# EAGLE design schematic (EAGLE 9.2.0)
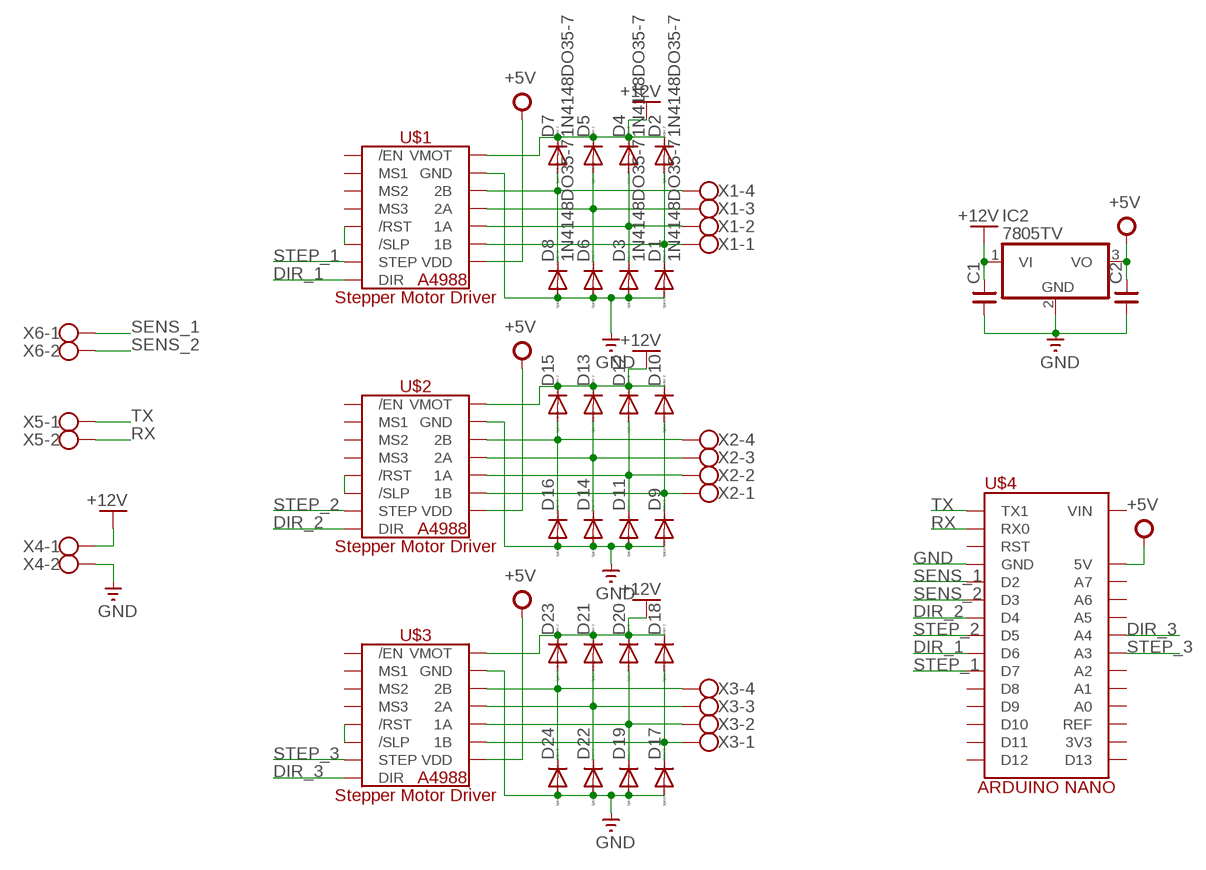
[diagram p0: schematic, sheet 1]

## Parts
C1  CNP-C035-055X025  [C035-055X025]
C2  CNP-C035-055X025  [C035-055X025]
D1  1N4148DO35-7  [DO35-7]
D2  1N4148DO35-7  [DO35-7]
D3  1N4148DO35-7  [DO35-7]
D4  1N4148DO35-7  [DO35-7]
D5  1N4148DO35-7  [DO35-7]
D6  1N4148DO35-7  [DO35-7]
D7  1N4148DO35-7  [DO35-7]
D8  1N4148DO35-7  [DO35-7]
D9  1N4148DO35-7  [DO35-7]
D10  1N4148DO35-7  [DO35-7]
D11  1N4148DO35-7  [DO35-7]
D12  1N4148DO35-7  [DO35-7]
D13  1N4148DO35-7  [DO35-7]
D14  1N4148DO35-7  [DO35-7]
D15  1N4148DO35-7  [DO35-7]
D16  1N4148DO35-7  [DO35-7]
D17  1N4148DO35-7  [DO35-7]
D18  1N4148DO35-7  [DO35-7]
D19  1N4148DO35-7  [DO35-7]
D20  1N4148DO35-7  [DO35-7]
D21  1N4148DO35-7  [DO35-7]
D22  1N4148DO35-7  [DO35-7]
D23  1N4148DO35-7  [DO35-7]
D24  1N4148DO35-7  [DO35-7]
IC2  7805TV  [TO220V]
U$1  A4988_STEP  [A4988_STEP]
U$2  A4988_STEP  [A4988_STEP]
U$3  A4988_STEP  [A4988_STEP]
U$4  NANO_HEADER  [NANO_HEADER]
X1  W237-4  [W237-4]
X2  W237-4  [W237-4]
X3  W237-4  [W237-4]
X4  W237-102  [W237-102]
X5  W237-102  [W237-102]
X6  W237-102  [W237-102]

## Nets
+5V: C2.2 IC2.3(VO) U$1.VDD U$2.VDD U$3.VDD U$4.5V
+12V: C1.2 D2.C D4.C D5.C D7.C D10.C D12.C D13.C D15.C D18.C D20.C D21.C D23.C IC2.1(VI) U$1.VMOT U$2.VMOT U$3.VMOT X4.1
DIR_1: U$1.DIR U$4.D6
DIR_2: U$2.DIR U$4.D4
DIR_3: U$3.DIR U$4.A4
GND: C1.1 C2.1 D1.A D3.A D6.A D8.A D9.A D11.A D14.A D16.A D17.A D19.A D22.A D24.A IC2.2(GND) U$1.GND U$1.GND2(GND) U$2.GND U$2.GND2(GND) U$3.GND U$3.GND2(GND) U$4.GND U$4.GND2(GND) X4.2
N$1: D1.C D2.A U$1.1B X1.1
N$2: U$1./RST U$1./SLP
N$3: D9.C D10.A U$2.1B X2.1
N$4: D3.C D4.A U$1.1A X1.2
N$5: D11.C D12.A U$2.1A X2.2
N$6: D5.A D6.C U$1.2A X1.3
N$7: D7.A D8.C U$1.2B X1.4
N$8: D13.A D14.C U$2.2A X2.3
N$9: D15.A D16.C U$2.2B X2.4
N$10: U$2./RST U$2./SLP
N$11: D17.C D18.A U$3.1B X3.1
N$12: D19.C D20.A U$3.1A X3.2
N$13: D21.A D22.C U$3.2A X3.3
N$17: D23.A D24.C U$3.2B X3.4
N$18: U$3./RST U$3./SLP
RX: U$4.RX0 X5.2
SENS_1: U$4.D2 X6.1
SENS_2: U$4.D3 X6.2
STEP_1: U$1.STEP U$4.D7
STEP_2: U$2.STEP U$4.D5
STEP_3: U$3.STEP U$4.A3
TX: U$4.TX1 X5.1
Unconnected: U$1./EN U$1.MS1 U$1.MS2 U$1.MS3 U$2./EN U$2.MS1 U$2.MS2 U$2.MS3 U$3./EN U$3.MS1 U$3.MS2 U$3.MS3 U$4.3V3 U$4.A0 U$4.A1 U$4.A2 U$4.A5 U$4.A6 U$4.A7 U$4.D8 U$4.D9 U$4.D10 U$4.D11 U$4.D12 U$4.D13 U$4.REF U$4.RST U$4.RST2(RST) U$4.VIN

## Library data of the parts
C1 C2 = cap-master:CNP-: NON-POLARIZED CAP
D1-D24 = diode:1N4148: DIODE high speed (Philips)
IC2 = linear:78*: Positive VOLTAGE REGULATOR Source: http://cache.national.com/ds/LM/LM78L05.pdf http://www.fairchildsemi.com/ds/LM/LM7805.pdf
U$1-U$3 = IC:A4988_STEP
U$4 = IC:NANO_HEADER: Arduino nano V3.0 femal header
X1-X3 = con-wago-500:W237-4: WAGO SCREW CLAMP; OC_FARNELL: unknown; OC_NEWARK: unknown
X4 = con-wago-500:W237-102: WAGO SCREW CLAMP; MPN: 237-102; OC_FARNELL: unknown; OC_NEWARK: 70K9898
X5 X6 = con-wago-500:W237-102: WAGO SCREW CLAMP; MPN: 237-102; OC_FARNELL: unknown; OC_NEWARK: 70K9898; SPICEPREFIX: X

## Board
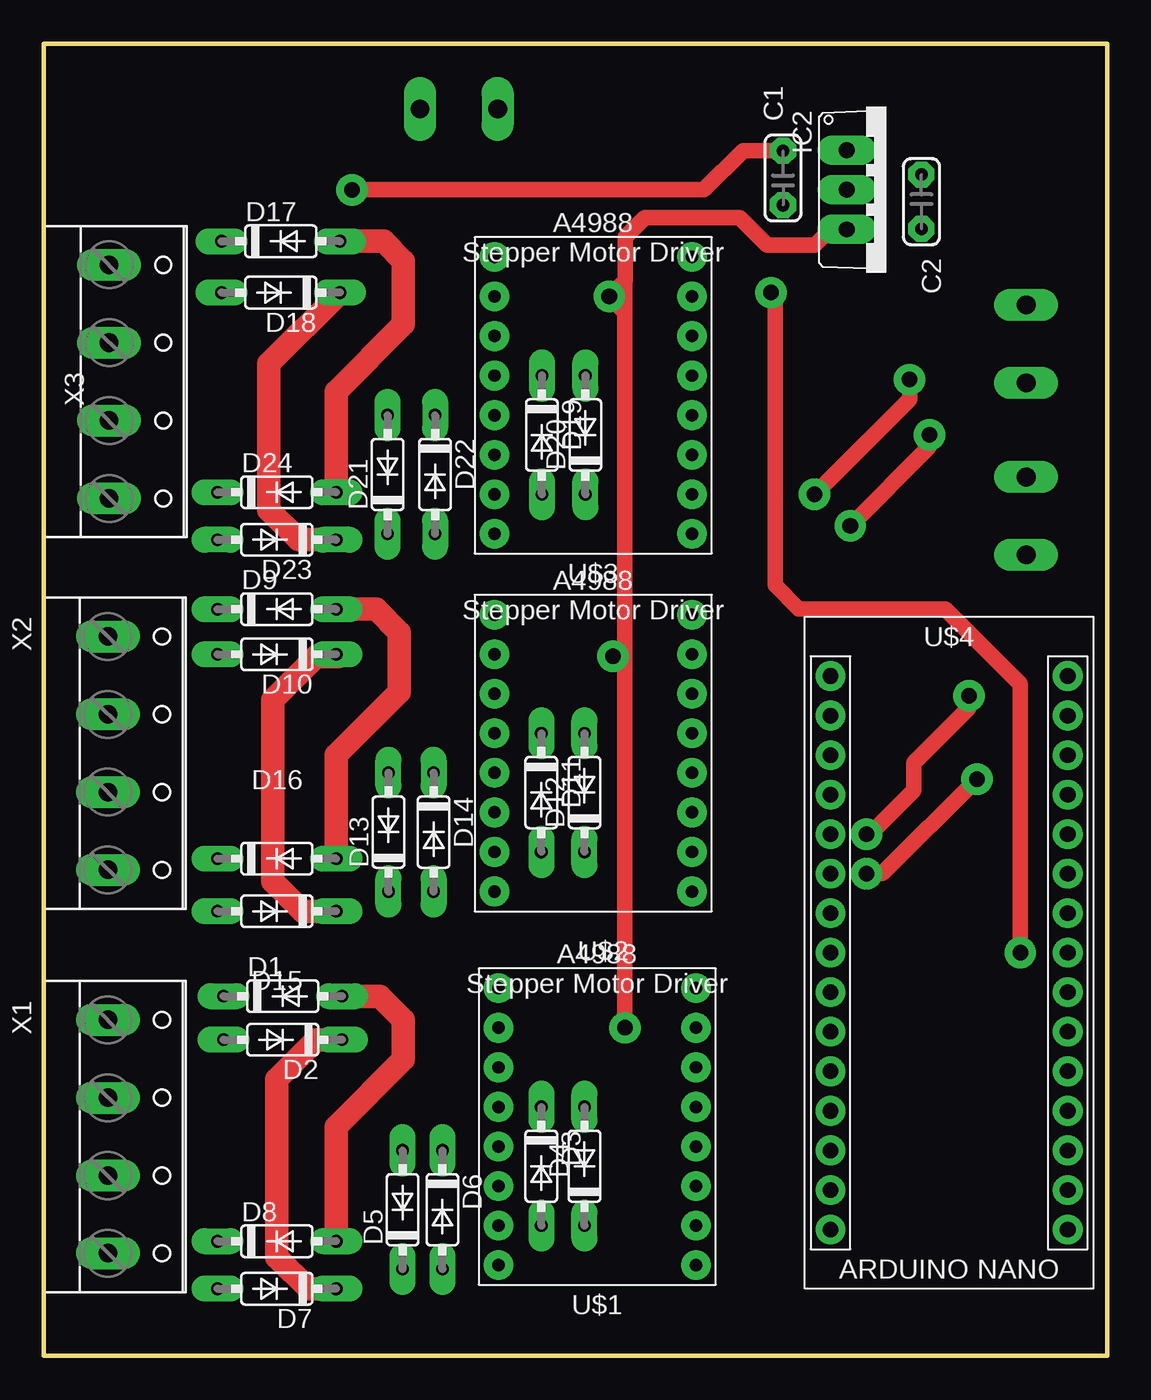
[diagram p1: board, top side]
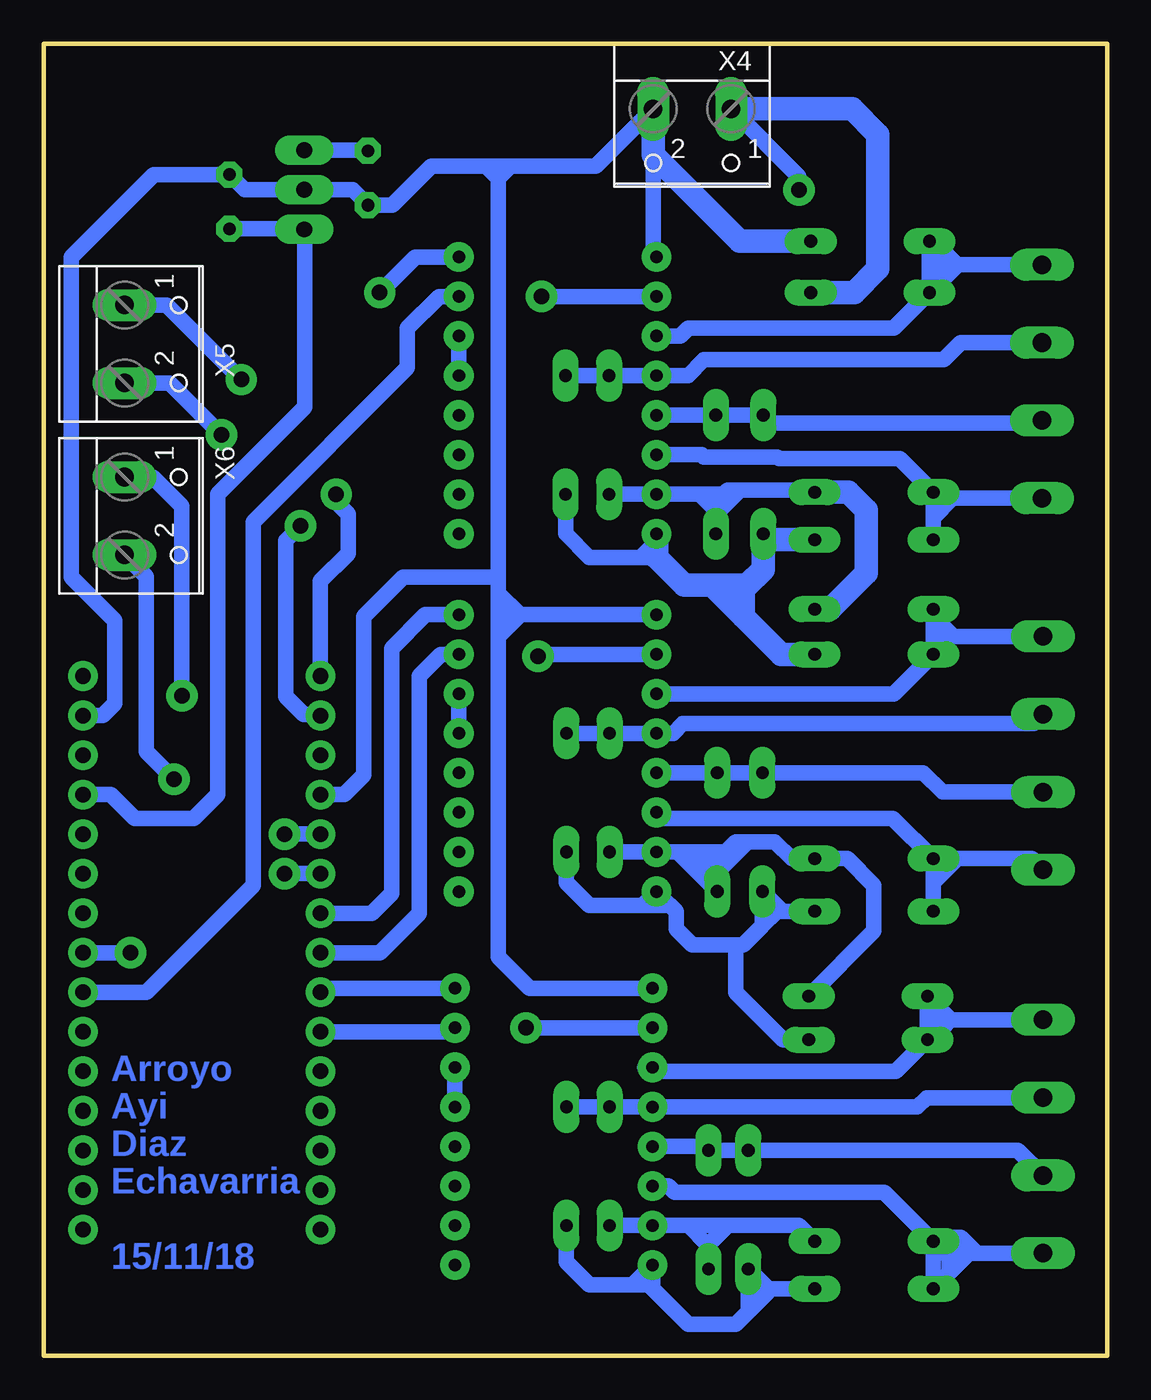
[diagram p2: board, bottom side, seen from below]

Size 68.33 x 84.33 mm. Coordinates in mm from the lower left corner, seen from the top.
Outline: 0,84.33 0,0 68.33,0 68.33,84.33 0,84.33
Copper layers (1*16): Top 0.035mm / dielectric 1.5mm / bottom 0.035mm
Design rules "default *": minimum track width 25mil, minimum drill 0.5mm, track to track 20mil, track to pad 20mil, pad to pad 20mil, via to via 20mil, smd to smd 20mil, copper to edge 40mil, drill to drill 6mil, minimum pad ring 17mil, minimum via ring 20mil, stop-mask expansion 4mil, vias tented up to drill 0mil, thermal gap 10mil

### Footprints (pad centres in the part's own frame; a part is rotated, then mirrored left to right if it is on the bottom)
C035-055X025 = drill 0.813 pad 1.676 octagon: 1 -1.587,0; 2 1.905,0
DO35-7 = drill 0.813 long: A 3.81,0; C -3.81,0
TO220V = drill 1.016 long: 1 -2.54,-2.54; 2 0,-2.54; 3 2.54,-2.54
A4988_STEP = drill 0.8 pad 1.905: 1A 6.35,-1.27; 1B 6.35,-3.81; 2A 6.35,1.27; 2B 6.35,3.81; /EN -6.35,8.89; /RST -6.35,-1.27; /SLP -6.35,-3.81; DIR -6.35,-8.89; GND 6.35,6.35; GND2 6.35,-8.89; MS1 -6.35,6.35; MS2 -6.35,3.81; MS3 -6.35,1.27; STEP -6.35,-6.35; VDD 6.35,-6.35; VMOT 6.35,8.89
NANO_HEADER = drill 1 pad 1.905: 3V3 16.51,6.35; 5V 16.51,31.75; A0 16.51,11.43; A1 16.51,13.97; A2 16.51,16.51; A3 16.51,19.05; A4 16.51,21.59; A5 16.51,24.13; A6 16.51,26.67; A7 16.51,29.21; D2 1.27,29.21; D3 1.27,26.67; D4 1.27,24.13; D5 1.27,21.59; D6 1.27,19.05; D7 1.27,16.51; D8 1.27,13.97; D9 1.27,11.43; D10 1.27,8.89; D11 1.27,6.35; D12 1.27,3.81; D13 16.51,3.81; GND 1.27,31.75; GND2 16.51,36.83; REF 16.51,8.89; RST 1.27,34.29; RST2 16.51,34.29; RX0 1.27,36.83; TX1 1.27,39.37; VIN 16.51,39.37
W237-4 = drill 1.194 long: 1 -7.5,-1.27; 2 -2.5,-1.27; 3 2.5,-1.27; 4 7.5,-1.27
W237-102 = drill 1.194 long: 1 -2.5,-1.27; 2 2.5,-1.27

### Placement (x,y rotation side)
C1  47.5,75.53 90 top
C2  56.39,74.33 270 top
D1  15.37,23.11 0 top
D2  15.37,20.32 180 top
D3  31.97,12.19 270 top
D4  34.74,12.19 90 top
D5  23.06,9.4 90 top
D6  25.62,9.4 270 top
D7  14.99,4.32 180 top
D8  14.99,7.37 0 top
D9  14.99,47.99 0 top
D10  14.99,45.08 180 top
D11  31.97,36.2 270 top
D12  34.74,36.2 90 top
D13  22.15,33.66 90 top
D14  25.06,33.66 270 top
D15  14.99,28.57 180 top
D16  14.99,31.95 0 top
D17  15.24,71.63 0 top
D18  15.24,68.33 180 top
D19  32,59.18 270 top
D20  34.8,59.18 90 top
D21  22.1,56.64 90 top
D22  25.15,56.64 270 top
D23  14.99,52.45 180 top
D24  14.99,55.5 0 top
IC2  54.13,74.93 270 top
U$1  35.56,14.73 180 top
U$2  35.31,38.73 180 top
U$3  35.31,61.72 180 top
U$4  49.28,4.32 0 top
X1  5.4,14.1 270 top
X2  5.4,38.73 270 top
X3  5.47,62.61 270 top
X4  26.67,78.87 180 bottom
X5  61.85,65.02 270 bottom
X6  61.85,53.97 270 bottom

### Tracks (layer width: path | path; a pad name or v marks a point on that pad's centre or on a via)
+5V  (via drill 1 pad 1.5)
  Top 1: IC2.3 50.55,72.39 49.53,71.37 46.48,71.37 44.7,73.15 38.61,73.15 37.35,71.89 37.35,69.09 37.34,69.08 | 37.34,45.72 37.34,44.96 | 37.34,44.96 37.34,44.2 | 37.34,44.2 v37.34,21.08 | 37.34,44.96 v36.58,44.96 | 37.34,45.72 v36.58,44.96 | 37.34,44.2 v36.58,44.96 | 37.34,69.08 37.34,68.07 | 37.34,68.07 37.34,67.07 | 37.34,67.07 37.34,45.72 | 37.34,68.07 v36.33,68.07 | 37.34,69.08 v36.33,68.07 | 37.34,67.07 v36.33,68.07
  bottom 1: U$2.VDD 36.58,45.09 v36.58,44.96 | v36.33,68.07 U$3.VDD | v37.34,21.08 U$1.VDD | C2.2 51.62,72.42 IC2.3 51.56,72.36 51.56,60.96 57.15,55.37 57.15,36.07 58.67,34.54 62.48,34.54 64.01,36.07 U$4.5V
+12V  (via drill 1 pad 1.5)
  Top 1: C1.2 44.93,77.44 42.42,74.93 v19.81,74.93
  Top 1.5: D23.C 16.38,52.45 14.48,54.36 14.48,63.75 D18.C | D15.C 16.64,28.57 14.73,30.48 14.73,42.16 17.53,44.96 18.92,44.96 D10.C | D2.C 17.53,20.32 14.99,17.78 14.99,6.35 17.02,4.32 D7.C
  bottom 1: 20.88,28.57 D15.C | 20.88,28.57 D13.C 22.15,27.63 | 23.88,26.42 23.37,26.42 22.15,27.63 | 23.88,26.42 26.67,26.42 27.69,27.43 27.69,28.57 28.13,29.02 | 28.13,29.02 U$2.VMOT 29.84,28.96 | D12.C 34.74,30.43 33.27,28.96 29.84,28.96 | 29.84,28.96 28.19,28.96 28.13,29.02 | 22.15,27.63 21.21,28.57 20.88,28.57 | D2.C 20.83,20.32 23.88,23.37 23.88,26.42 | 22.32,4.85 D5.C 23.06,2.85 | 22.32,4.85 21.79,4.32 | 29.21,4.32 U$1.VMOT 30.48,4.57 | 29.21,4.32 26.92,2.03 23.88,2.03 23.06,2.85 | 21.79,4.32 D7.C | 23.06,2.85 22.48,3.43 | 22.48,3.43 21.79,4.12 21.79,4.32 | 30.48,4.57 33.27,4.57 34.74,6.04 D4.C | 29.21,4.32 29.46,4.57 30.48,4.57 | D21.C 22.1,52.32 | 28.96,52.32 28.96,51.31 29.97,51.31 | U$3.VMOT 28.96,52.32 | 29.97,51.31 28.96,52.32 | 29.97,51.31 33.27,51.31 34.8,52.83 D20.C | X4.1 19.81,75.78 v19.81,74.93 | IC2.1 47.53,77.47 C1.2 | 22.48,3.43 22.48,4.7 22.32,4.85
  bottom 1.5: U$3.VMOT 28.96,51.31 27.18,49.53 25.4,49.53 | 25.4,49.53 25.15,49.53 | 25.15,49.53 23.11,49.53 | 23.11,49.53 22.1,50.55 22.1,52.32 | D23.C 21.72,52.45 D21.C | D10.C 20.95,45.09 23.37,47.5 | 23.37,47.75 23.37,49.28 23.11,49.53 | 23.37,47.75 23.37,47.5 | 25.15,49.53 23.37,47.75 | 25.4,49.53 23.37,47.5 | X4.1 16.38,80.14 14.73,78.49 14.73,69.85 16.26,68.33 D18.C
DIR_1
  bottom 1: U$4.D6 50.29,23.62 U$1.DIR
DIR_2
  bottom 1: U$4.D4 47.24,28.45 45.97,29.72 45.97,45.47 43.81,47.62 U$2.DIR
DIR_3  (via drill 1 pad 1.5)
  Top 1: v46.74,68.33 46.99,68.07 46.99,49.53 48.51,48.01 57.91,48.01 62.74,43.18 v62.74,25.91
  bottom 1: U$3.DIR 44.45,70.61 v46.74,68.33 | U$4.A4 v62.74,25.91
GND
  Top 1.5: D16.A 18.8,38.61 22.86,42.67 22.86,46.48 21.35,47.99 D9.A | D8.A 18.8,14.73 23.11,19.05 23.11,21.59 21.59,23.11 D1.A | D24.A 18.8,61.98 23.11,66.29 23.11,70.36 21.84,71.63 D17.A
  bottom 1: D11.A U$2.GND 27.59,32.38 | 26.96,31.75 D14.A | D14.A 25.15,29.94 25.15,30.99 | 25.15,31.75 25.15,30.99 | 23.11,33.04 21.35,33.04 20.27,31.95 D16.A 16.71,31.95 14.99,30.23 14.99,27.3 D1.A | 23.11,33.04 23.86,33.04 24.51,32.38 | 25.15,31.75 24.51,32.38 | 25.91,31.75 25.15,31.75 | 26.96,31.75 25.91,31.75 | 27.59,32.38 26.96,31.75 | 25.91,31.75 25.15,30.99 | 27.59,32.38 24.51,32.38 | D14.A 25.05,31.09 23.11,33.04 | D8.A 19.81,8.38 24.38,8.38 | 26.92,8.38 24.38,8.38 | 26.92,8.38 U$1.GND D3.A | 26.92,8.38 25.62,7.08 D6.A 25.62,7.15 24.38,8.38 | D19.A U$3.GND 26.16,55.37 | 39.12,46.23 39.12,25.65 37.08,23.62 U$1.GND2 | 39.12,46.48 39.12,46.23 | 39.12,47.75 39.12,46.48 | 39.12,49.02 39.12,47.75 | 39.12,49.02 37.72,47.62 | 37.72,47.62 37.97,47.62 38.48,47.12 | 39.12,46.48 38.48,47.12 | 39.12,46.23 37.72,47.62 | 39.12,47.75 38.48,47.12 | U$3.GND2 29.17,70.83 29.17,77.18 | X4.2 32.85,76.45 38.35,76.45 | 39.12,76.45 38.35,76.45 | 39.88,76.45 39.12,76.45 | 39.88,76.45 43.43,76.45 45.94,73.95 C1.1 48.48,74.93 IC2.2 55.4,74.93 C2.1 61.25,75.91 66.55,70.61 66.55,50.04 63.75,47.24 63.75,41.91 64.52,41.15 U$4.GND2 | 39.12,50.04 45.21,50.04 47.75,47.5 47.75,37.34 49.02,36.07 U$4.GND | D24.A 18.92,55.63 23.62,55.63 | 23.62,55.63 24.38,55.63 24.64,55.37 | 26.16,55.37 24.64,55.37 | D22.A 25.15,54.86 24.64,55.37 | D22.A 25.15,54.36 26.16,55.37 | D22.A 25.15,54.1 23.62,55.63 | 37.72,47.62 U$2.GND2 | 39.12,50.04 39.12,49.02 | 39.12,75.69 39.12,50.04 | 39.12,76.45 39.12,75.69 | 39.12,75.69 38.35,76.45 | 39.88,76.45 39.12,75.69
  bottom 1.5: D24.A 16.64,55.5 15.49,54.36 15.49,50.29 17.8,47.99 D9.A | D17.A 23.62,71.63 29.17,77.18 X4.2
N$1
  bottom 1: 10.04,21.6 X1.1 | D1.C 10.04,21.6 | D1.C D2.A | D2.A 11.32,20.32 10.61,21.03 | 10.61,21.03 10.04,21.6 | D1.C 11.56,22.23 | D2.A 13.59,18.29 29.46,18.29 29.72,18.54 U$1.1B | D1.C 11.56,21.97 10.61,21.03
N$2
  bottom 1: U$1./SLP U$1./RST
N$3
  bottom 1: U$2.1B 13.72,42.55 D10.A | 9.91,46.23 X2.1 | D10.A D9.C 11.18,47.51 9.91,46.23 | D10.A 10.03,46.23 9.91,46.23
N$4
  bottom 1: D4.A D3.C U$1.1A 12.19,16 11.6,16.6 X1.2
N$5
  bottom 1: X2.2 4.72,40.64 27.25,40.64 27.89,40.01 U$2.1A D11.C D12.A
N$6
  bottom 1: U$1.2A 25.87,13.46 D6.C D5.A 5.74,13.21 X1.3
N$7
  bottom 1: 8.38,6.6 X1.4 | 8.9,6.6 8.38,6.6 | 8.9,6.6 10.41,6.6 D8.C | D8.C D7.A 10.16,5.33 | 10.16,5.33 8.9,6.6 | D8.C 10.16,6.35 10.16,5.33 | 8.38,6.6 9.4,7.62 11.43,7.62 11.68,7.37 D8.C | D8.C 14.33,10.52 27.8,10.52 28.19,10.92 U$1.2B
N$8
  bottom 1: U$2.2A D14.C D13.A 11.81,37.47 10.58,36.23 X2.3
N$9
  bottom 1: D16.C 9.65,31.95 | 9.65,31.95 4.85,31.95 X2.4 | D16.C 13.77,34.54 28.57,34.54 U$2.2B | D16.C D15.A 11.18,30.43 9.65,31.95
N$10
  bottom 1: U$2./SLP U$2./RST
N$11
  bottom 1: U$3.1B 27.43,65.53 26.92,66.04 13.72,66.04 D18.A | 11.43,69.36 D18.A | 11.43,70.87 11.43,69.36 | 11.43,70.87 D17.C 11.17,71.63 9.65,70.11 | 9.65,70.11 X3.1 | 10.68,70.11 9.65,70.11 | 11.43,70.87 10.68,70.11 | 11.43,69.36 10.68,70.11 | D18.A 9.65,70.1 9.65,70.11
N$12
  bottom 1: D20.A D19.C U$3.1A 26.92,62.99 25.91,64.01 10.5,64.01 9.4,65.11 X3.2
N$13
  bottom 1: U$3.2A D22.C D21.A 21.59,59.94 4.37,59.94 X3.3
N$14
  bottom 0.3: 68.33,84.33 68.33,0
N$15
  bottom 0.3: 68.33,84.33 0,84.33
N$16
  bottom 0.3: 0,84.33 0,0
N$17
  bottom 1: U$3.2B 26.05,57.91 25.91,57.77 21.19,57.77 21.08,57.66 13.34,57.66 D24.C | 9.91,55.11 X3.4 | 9.91,55.11 10.79,55.11 D24.C | 11.18,53.85 D23.A | D24.C 11.18,53.85 | 11.18,53.85 9.91,55.11
N$18
  bottom 1: U$3./SLP U$3./RST
N$19
  bottom 0.3: 68.33,0 0,0
RX  (via drill 1 pad 1.5)
  Top 1: v56.9,59.18 56.9,58.42 v51.82,53.34
  bottom 1: U$4.RX0 50.62,41.22 51.61,41.22 52.76,42.37 52.76,52.4 v51.82,53.34 | v56.9,59.18 60.24,62.52 X5.2
SENS_1  (via drill 1 pad 1.5)
  Top 1: v52.85,33.53 53.1,33.53 55.9,36.32 55.9,38.1 59.44,41.64 v59.44,42.42
  bottom 1: v52.85,33.53 U$4.D2 | v59.44,42.42 59.44,54.61 61.3,56.47 X6.1
SENS_2  (via drill 1 pad 1.5)
  Top 1: v52.85,30.99 53.88,30.99 v59.96,37.07
  bottom 1: v52.85,30.99 U$4.D3 | v59.96,37.07 61.72,38.83 61.72,50.08 X6.2
STEP_1
  bottom 1: U$1.STEP 42.16,20.83 U$4.D7
STEP_2
  bottom 1: U$2.STEP 42.8,45.09 44.2,43.69 44.2,28.45 46.74,25.91 U$4.D5
STEP_3
  bottom 1: U$4.A3 61.72,23.37 54.86,30.23 54.86,53.59 44.96,63.5 44.96,66.04 42.93,68.07 U$3.STEP
TX  (via drill 1 pad 1.5)
  Top 1: v55.63,62.74 55.63,61.47 v49.53,55.37
  bottom 1: v49.53,55.37 49.53,54.86 48.77,54.1 48.77,51.56 50.55,49.78 U$4.TX1 | v55.63,62.74 60.41,67.52 X5.1

### Text on the board
bottom: Arroyo / Ayi / Diaz / Echavarria / / 15/11/18